# Altium schematic sheet Quad FC power V10.5.SchDoc
size A4; SheetNumber: 2; SheetTotal: 2
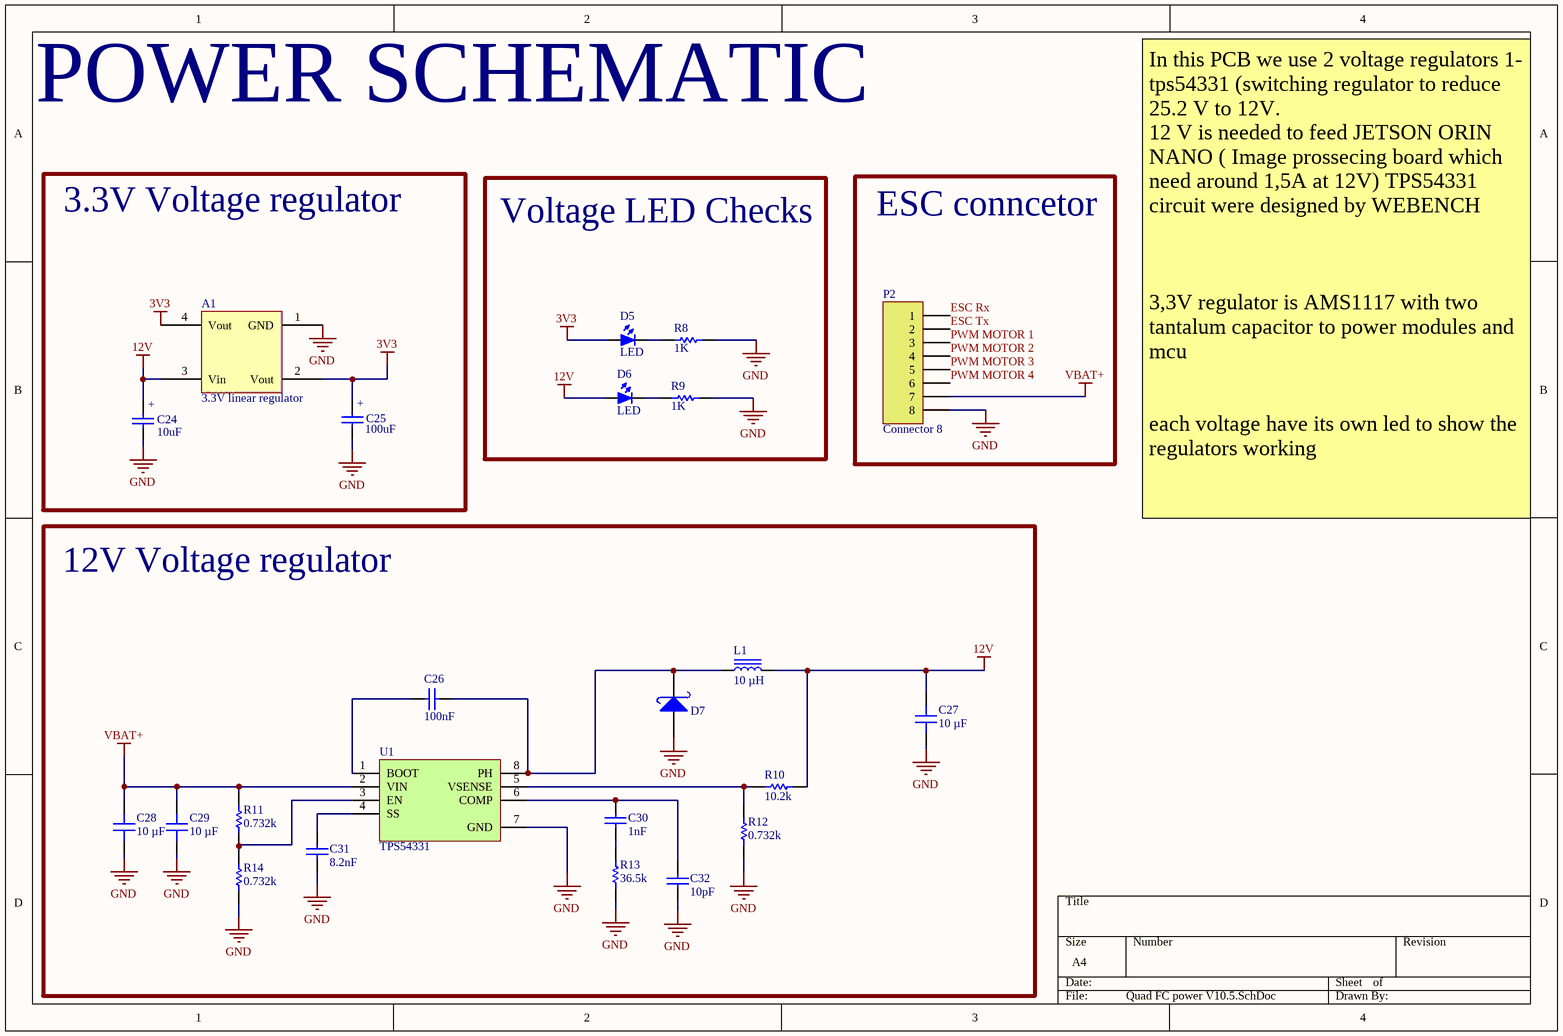
[diagram p0: Quad FC power V10.5.SchDoc]

## Parts
A1  3.3V linear regulator  [SOT230P700X180-4N]
C24  10uF  [MY_CAP_SMD-B]
C25  100uF  [MY_CAP_SMD-B]
C26  100nF  [CAP0603]
C27  10 µF  [CAP 0805_2012]
C28  10 µF  [CAP 0805_2012]
C29  10 µF  [CAP 0805_2012]
C30  1nF  [CAP0603]
C31  8.2nF  [CAP0603]
C32  10pF  [CAP0603]
D5  LED  [0603 - LED]
D6  LED  [0603 - LED]
D7  1n5822  [DIOM4226X244N]  (value not drawn)
L1  10 µH  [TAIYO YUDEN NRS8030]
P2  Connector 8  [JST B8B-PH-K]
R8  1K  [RES0603]
R9  1K  [RES0603]
R10  10.2k  [RES0603]
R11  0.732k  [RES0603]
R12  0.732k  [RES0603]
R13  36.5K  [RES0603]
R14  0.732k  [RES0603]
U1  TPS54331  [SO8]

## Blocks framed on the sheet
3.3V Voltage regulator: A1 C24 C25
Voltage LED Checks: D5 D6 R8 R9
ESC conncetor: P2
12V Voltage regulator: C26-C32 D7 L1 R10-R14 U1

## Nets
3V3: A1.2(Vout) A1.4(Vout) C25.+ D5.1(A)
12V: A1.3(Vin) C24.+ C27.2 D6.1(A) L1.2 R10.2
GND: A1.1(GND) C24.- C25.- C27.1 C28.1 C29.1 C31.2 C32.2 D7.1(A) P2.8 R8.2 R9.2 R12.1 R13.1 R14.1 U1.7(GND)
VBAT+: C28.2 C29.2 P2.7 R11.2 U1.2(VIN)
ESC Rx: P2.1
ESC Tx: P2.2
PWM MOTOR 1: P2.3
PWM MOTOR 2: P2.4
PWM MOTOR 3: P2.5
PWM MOTOR 4: P2.6
NetC26_1: C26.1 D7.2(K) L1.1 U1.8(PH)
NetC26_2: C26.2 U1.1(BOOT)
NetC30_1: C30.1 C32.1 U1.6(COMP)
NetC30_2: C30.2 R13.2
NetC31_1: C31.1 U1.4(SS)
NetD5_2: D5.2(K) R8.1
NetD6_2: D6.2(K) R9.1
NetR10_1: R10.1 R12.2 U1.5(VSENSE)
NetR11_1: R11.1 R14.2 U1.3(EN)

## Notes on the sheet
- POWER SCHEMATIC
- In this PCB we use 2 voltage regulators 1- tps54331 (switching regulator to reduce 25.2 V to 12V.
  12 V is needed to feed JETSON ORIN NANO ( Image prossecing board which need around 1,5A at 12V) TPS54331 circuit were designed by WEBENCH
  3,3V regulator is AMS1117 with two tantalum capacitor to power modules and mcu
  each voltage have its own led to show the regulators working

## Library data of the parts
A1 = ams1117
C24 C25 = CAP_TANTAL_B: 3.5X2.8MM; Value: 3300u
C26 C30-C32 = CAP SMD PACKAGE: F407VET6 Power CAP; Designer: Abbas Basereh; Desc.: CAP SMD TOTAL PACKAGES; Data: 2017-3-10
C27-C29 = GRM21BR61H106KE43K: CAP CER 10UF 50V X5R 0805; manufacturer: Murata Electronics; Tolerance: ±10%; Part Number: GRM21BR61H106KE43K; Value: 10 µF; Applications: General Purpose; Capacitance: 10 µF; componentlink1description: Datasheet; componentlink1url: https://search.murata.co.jp/Ceramy/image/img/A01X/G101/ENG/GRM21BR61H106KE43-01A.pdf; componentlink2description: DigiKey Link; componentlink2url: https://www.digikey.com/en/products/detail/murata-electronics/GRM21BR61H106KE43K/15191954; Device Package: 0805 (2012 Metric); lastupdated: 2/9/2024 8:15:01 PM; Lifecycle Status: Active; Minimum Order: 1; Mounting Type: Surface Mount, MLCC; Operating Temperature: -55°C ~ 85°C; Package / Case: 0805 (2012 Metric); packaging: TapeAndReel; partid: 40508; Part Status: Active; price: 0.05; series: GRM; Size / Dimension: 0.079" L x 0.049" W (2.00mm x 1.25mm); Supplier 1: DigiKey; Supplier Part Number 1: 490-GRM21BR61H106KE43KCT-ND; Temperature Coefficient: X5R; Thickness (Max): 0.057" (1.45mm); Voltage - Rated: 50V
D7 = 1n5822 SMD: Schottky Rectifiers; Part. No: SS34; Manufacturer: ON Semiconductor/Fairchild; Designer: Abbas Basereh; Link: https://www.aliexpress.com/item/Free-shipping-100pcs-1n5822-sma-smd-do-214ac-Schottky-diode-ss34/32337482329.html?spm=2114.01010208.3.1.zLZDsP&ws_ab_test=searchweb0_0,searchweb201602_4_10065_10068_10084_10083_10080_10082_10081_10060_10061_10062_10056_10055_10054_10059_10099_10078_10079_427_10073_10103_10102_10096_10052_10050_10051,searchweb201603_4&btsid=6e50dc92-ac69-45bc-a19e-209af19ce602; Link: http://www.tme.eu/en/details/ss34/smd-schottky-diodes/vishay/ss34-e357t/; Link: http://www.digikey.com/product-detail/en/on-semiconductor-fairchild/SS34/SS34FSCT-ND/2094459; Data: 16-12-2016
L1 = NRS8030T100MJGJV: FIXED IND 10UH 3A 42.9 MOHM SMD; Manufacturer: Taiyo Yuden; Current - Saturation: 2.4A; DC Resistance (DCR): 42.9mOhm Max; Frequency - Self Resonant: 27MHz; Inductance Frequency - Test: 100 kHz; Material - Core: Ferrite; Shielding: Shielded; Tolerance: ±20%; Type: Drum Core, Wirewound; Part Number: NRS8030T100MJGJV; ComponentLink1Description: Datasheet; ComponentLink1URL: https://ds.yuden.co.jp/TYCOMPAS/ut/detail?pn=NRS8030T100MJGJV  &u=M; ComponentLink2Description: DigiKey Link; ComponentLink2URL: https://www.digikey.com/en/products/detail/taiyo-yuden/NRS8030T100MJGJV/4693986; Current Rating (Amps): 3 A; Device Package: Nonstandard; Height - Seated (Max): 0.118" (3.00mm); Inductance: 10 µH; LastUpdated: 2/8/2024 9:55:48 PM; Lifecycle Status: Active; Minimum Order: 1; Mounting Type: Surface Mount; Operating Temperature: -40°C ~ 125°C; Package / Case: Nonstandard; Packaging: TapeAndReel; PartId: 5482; Part Status: Active; Price: 0.23; Ratings: AEC-Q200; Series: NR, S Type; Size / Dimension: 0.315" L x 0.315" W (8.00mm x 8.00mm); Supplier 1: DigiKey; Supplier Part Number 1: 587-3647-1-ND; Value: 10 µH
P2 = Connector1x8: Connector, 8-Pin2.5mm; LatestRevisionDate: 17-Jul-2002; LatestRevisionNote: Re-released for DXP Platform.; Publisher: Altium Limited
R8-R14 = RES SMD PACKAGE: TOTAL SMD RESISTOR PACK; Designer: Abbas Basereh; Desc.: RES SMD PAKAGES; Data: 2017-3-10
  R8 R9: VALUE: 1K
  R10: VALUE: 10.2k
  R11 R12 R14: VALUE: 0.732k
  R13: VALUE: 36.5k
U1 = TPS54331: DC/DC Switching Regulators 2A,28V,1MHz Step Down SWIFT DC/D;Output Voltage:0.8 V to 25 V; Link: http://javanelec.com/productsDetails.aspx?id=33786
D5 D6 = LED: Published: 8-Jun-2000; LatestRevisionDate: 08-Jul-2005; LatestRevisionNote: Mech Layer 1 removed.; PackageReference: LED-0; Publisher: Altium Limited